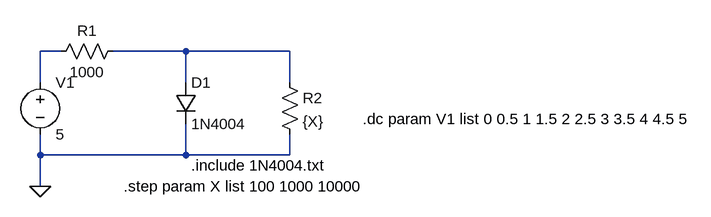
[diagram p0: schematic Lab1Pre2.asc]
Lab1Pre2.asc, the LTspice schematic file:
Version 4
SHEET 1 1104 680
WIRE 64 80 32 80
WIRE 256 80 144 80
WIRE 416 80 256 80
WIRE 32 128 32 80
WIRE 256 128 256 80
WIRE 416 128 416 80
WIRE 32 240 32 208
WIRE 256 240 256 192
WIRE 256 240 32 240
WIRE 416 240 416 208
WIRE 416 240 256 240
WIRE 32 288 32 240
FLAG 32 288 0
SYMBOL diode 240 128 R0
SYMATTR InstName D1
SYMATTR Value 1N4004
SYMBOL voltage 32 112 R0
WINDOW 123 0 0 Left 2
WINDOW 39 0 0 Left 2
SYMATTR InstName V1
SYMATTR Value 5
SYMBOL res 160 64 R90
WINDOW 0 0 56 VBottom 2
WINDOW 3 32 56 VTop 2
SYMATTR InstName R1
SYMATTR Value 1000
SYMBOL res 400 112 R0
SYMATTR InstName R2
SYMATTR Value {X}
TEXT 264 256 Left 2 !.include 1N4004.txt
TEXT 160 288 Left 2 !.step param X list 100 1000 10000
TEXT 528 184 Left 2 !.dc param V1 list 0 0.5 1 1.5 2 2.5 3 3.5 4 4.5 5

The netlist it stands for:
* Lab1Pre2.asc
D1 N002 0 1N4004
V1 N001 0 5
R1 N002 N001 1000
R2 N002 0 {X}
.model D D
.lib standard.dio
.include 1N4004.txt
.step param X list 100 1000 10000
.dc param V1 list 0 0.5 1 1.5 2 2.5 3 3.5 4 4.5 5
.backanno
.end